# Altium schematic sheet REGENIX_USB-C.SchDoc
size Tabloid; Date: Date; Author: Author 1; DocumentNumber: 3; Revision: 1; SheetNumber: 7; SheetTotal: 17; Size: 11x17; Sheet_Name: ESP32
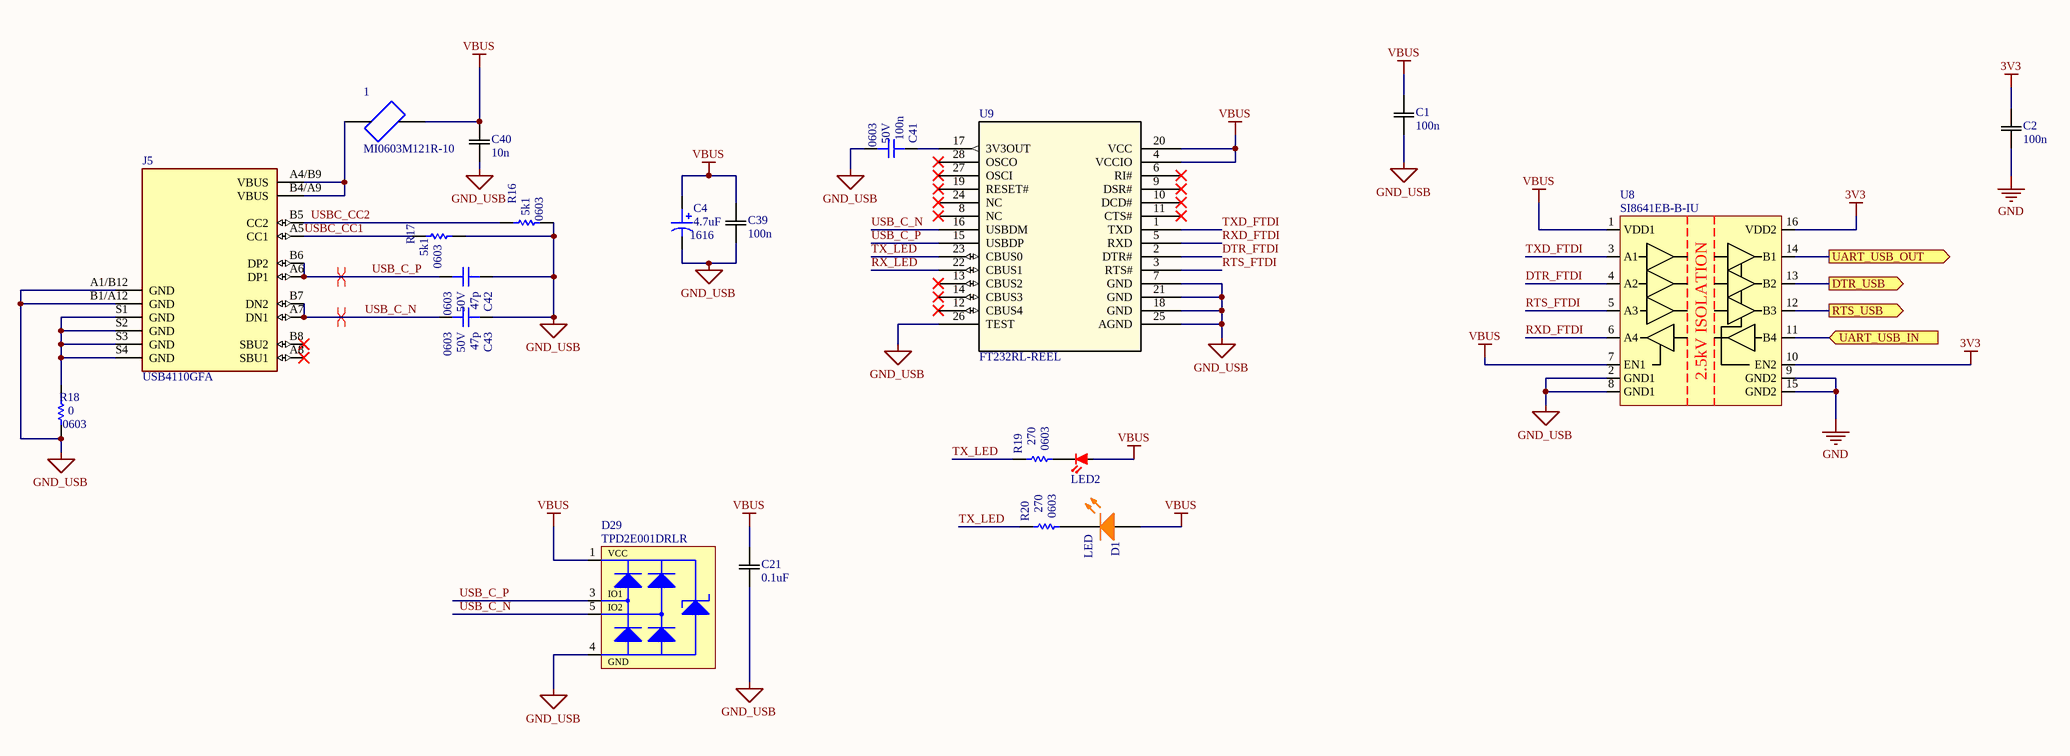
[diagram p0: REGENIX_USB-C.SchDoc]

## Parts
1  MI0603M121R-10  [FB_MI0603M121R-10]
C1  100n  [CAP_CL10_SAM]
C2  100n  [CAP_CL10_SAM]
C4  value 4.7uF  Package: 1616  [CAP_ALU_1616_vishay]  (hidden comment: MAL214699108E3)
C21  0.1uF  [CAP_CL10_SAM]
C39  100n  [CAP_CL10_SAM]
C40  10n  [CAP_CL10_SAM]
C41  value 100n  Voltage: 50V  Package: 0603  [CAP_0603]  (hidden comment: CAP - 0603)
C42  value 47p  Voltage: 50V  Package: 0603  [CAP_0603]  (hidden comment: CAP - 0603)
C43  value 47p  Voltage: 50V  Package: 0603  [CAP_0603]  (hidden comment: CAP - 0603)
D1  LED  [LED_0603]
D29  TPD2E001DRLR  [TVS_USB_TPD2E001DRLR]
J5  USB4110GFA  [GCT_USB4110GFA]
LED2  B1911USD-20D000114U1930  [LED-0603-2PIN]  (value not drawn)
R16  value 5k1  Package: 0603  [RES_0603]  (hidden comment: RES - 0603)
R17  value 5k1  Package: 0603  [RES_0603]  (hidden comment: RES - 0603)
R18  value 0  Package: 0603  [RES_0603]  (hidden comment: RES - 0603)
R19  value 270  Package: 0603  [RES_0603]  (hidden comment: RES - 0603)
R20  value 270  Package: 0603  [RES_0603]  (hidden comment: RES - 0603)
U8  SI8641EB-B-IU  [ISO_SI8641EB-B-IU]
U9  FT232RL-REEL  [IC28_SSOP-28_FTD]

## Ports
DTR_USB (out), RTS_USB (out), UART_USB_IN (in), UART_USB_OUT (out)

## Nets
3V3: C2.2 U8.10(EN2) U8.16(VDD2)
GND: C2.1 U8.9(GND2) U8.15(GND2)
GND_USB: C1.1 C4.2 C21.1 C39.1 C40.1 C41.1 C42.2 C43.2 D29.4(GND) J5.A1/B12(GND) J5.B1/A12(GND) R16.1 R17.1 R18.1 U8.2(GND1) U8.8(GND1) U9.7(GND) U9.18(GND) U9.21(GND) U9.25(AGND) U9.26(TEST)
VBUS: 1.2 C1.2 C4.1 C21.2 C39.2 C40.2 D1.A D29.1(VCC) LED2.2(R) U8.1(VDD1) U8.7(EN1) U9.4(VCCIO) U9.20(VCC)
DTR_FTDI: U8.4(A2) U9.2(DTR#)
DTR_USB: U8.13(B2) ; port DTR_USB
RTS_FTDI: U8.5(A3) U9.3(RTS#)
RTS_USB: U8.12(B3) ; port RTS_USB
RX_LED: U9.22(CBUS1)
RXD_FTDI: U8.6(A4) U9.5(RXD)
TX_LED: R19.2 R20.2 U9.23(CBUS0)
TXD_FTDI: U8.3(A1) U9.1(TXD)
UART_USB_IN: U8.11(B4) ; port UART_USB_IN
UART_USB_OUT: U8.14(B1) ; port UART_USB_OUT
USB_C_N: C43.1 D29.5(IO2) J5.A7(DN1) J5.B7(DN2) U9.16(USBDM)
USB_C_P: C42.1 D29.3(IO1) J5.A6(DP1) J5.B6(DP2) U9.15(USBDP)
USBC_CC1: J5.A5(CC1) R17.2
USBC_CC2: J5.B5(CC2) R16.2
Net1_1: 1.1 J5.A4/B9(VBUS) J5.B4/A9(VBUS)
NetC41_2: C41.2 U9.17(3V3OUT)
NetD1_K: D1.K R20.1
NetJ5_S1: J5.S1(GND) J5.S2(GND) J5.S3(GND) J5.S4(GND) R18.2
NetLED2_1: LED2.1(K) R19.1

Not connected (* = marked no-connect by the designer): D29 2(NC); J5 A8(SBU1)* B8(SBU2)*; U9 6(RI#)* 8(NC)* 9(DSR#)* 10(DCD#)* 11(CTS#)* 12(CBUS4)* 13(CBUS2)* 14(CBUS3)* 19(RESET#)* 24(NC)* 27(OSCI)* 28(OSCO)*

## Layout directives
differential pair: USB_C_N, USB_C_P

## Notes on the sheet
- Sheet Name
- Project Title
- Global Project
- Revision
- Size
- Date
- Group
- Sheet
- of
- Filename
- Designers
- (in symbol ISO_SI8641EB-B-IU) 2.5kV ISOLATION

## Library data of the parts
1 = MI0603M121R-10: Ferrite Bead (Chip Bead), 1.6 x 0.8 x 0.8mm (0603), 120Ohms impedance at 25 MHz; MF: Laird; Package: 0603 Laird; MP: MI0603M121R-10; Check_prices: https://www.snapeda.com/parts/MI0603M121R-10/Laird/view-part/332874/?ref=eda; Value: *; Price: None; Availability: In Stock; SnapEDA_Link: https://www.snapeda.com/parts/MI0603M121R-10/Laird/view-part/332874/?ref=snap
C1 C2 C21 C39 C40 = CL10B104KB8NNWC: CAP CER 0.1UF 50V X7R 0603 CL10B104KB8NNWC; Mfr_Name: Samsung
C4 = CAP_ALU_MAL214699108E3: CAP - ALU 470uF 20% 50V - 1616; Current: 1.3A; Mfg: Vishay Dale; Mfg Part Number: MAL214699108E3; HelpURL: http://www.vishay.com/docs/28403/146cti.pdf; CreatedBy: Jonathan Bouchard; Temperature: -55°C to 125°C; Power: *; Supplier 1: Digikey; Supplier Part Number 1: 4442PHCT-ND
C41-C43 = CAP - 0603: Precision: 10%; Current: *; CreatedBy: Jonathan Bouchard; Power: *
D1 = LED_SML-311DTT86: LED - 611nM ORANGE 2mA - 0603 SML-311DTT86; Voltage: 1.8V; Mfg: ROHM Semiconductor; Power: 44mW; Current: 2mA; HelpURL: http://media.digikey.com/pdf/Data%20Sheets/Rohm%20PDFs/SML-311%20Series.pdf; CreatedBy: Jonathan Bouchard; Temperature: -40°C to 85°C; Package: 0603; Precision: *; Mfg Part Number: SML-311DTT86; Supplier 1: Digikey; Supplier Part Number 1: 511-1303-1-ND
D29 = TVS_USB_TPD2E001DRLR: TVS - USB TVS DIODE 5.5V - SOT-553; Manufacturer #1: Texas Instruments; Value: 11V Breakdown; Voltage Rating: 5.5V (Max); GRAMS Lib Spec: 2.8; Magnetic Material: YES; Cryo: UNKNOWN; Tolerance: *; Current Rating: *; Power Max: *; HelpURL: http://www.ti.com/lit/ds/symlink/tpd2e001.pdf; CreatedBy/Date: Jonathan Bouchard 2018-07-10; VerifiedBy: Arnaud Samson 16-07-18; Temperature: -40°C ~ 85°C (TA); Package: SOT-553; Manufacturer #2: *; Note: *; Assembly Type: SMD; Part Number #2: *; Part Number #1: TPD2E001DRLR; Polarized: YES; Supplier 1: Digi-Key; Supplier Part Number 1: 296-21883-1-ND
J5 = USB4110GFA: USB-C (USB TYPE-C) USB 2.0 Receptacle Connector 24 (16+8 Dummy) Position Surface Mount, Right Angle; MF: Global Connector Technology; SnapEDA_Link: https://www.snapeda.com/parts/USB4110GFA/Global+Connector+Technology/view-part/?ref=snap; Package: None; Value: *; MP: USB4110GFA; Check_prices: https://www.snapeda.com/parts/USB4110GFA/Global+Connector+Technology/view-part/?ref=eda
LED2 = B1911USD-20D000114U1930: LED RED CLEAR 1608 SMD; Package / Case: 0603 (1608 Metric); Mounted: Yes; Supplier 1: Digi-Key; Supplier Part Number 1: 3147-B1911USD-20D000114U1930CT-ND
U8 = ISO_SI8641EB-B-IU: ISO - Quad-Channel Digital Isolator - 16-SSOP; Manufacturer #1: Silicon Labs; Part Number #1: SI8641BA-B-IUR; Voltage Rating: 2.375-5.5V; GRAMS Lib Spec: 2.8c; Magnetic Material: Unknown; Polarized: Yes; Value: *; Tolerance: *; Current Rating: *; Power Max: *; HelpURL: https://www.silabs.com/documents/public/data-sheets/si864x-datasheet.pdf; CreatedBy/Date: Louis-Daniel Gaulin / 25-02-2020; VerifiedBy: C.Paulin - 9/03/2020; Temperature: -40°C ~ 125°C; Package: 16-SSOP; Manufacturer #2: *; Assembly Type: SMD; Part Number #2: *; Supplier 1: Digi-Key; Supplier Part Number 1: 336-4333-1-ND; Cryo: UNKNOWN
U9 = FT232RL-REEL: No Description Available; Mfr_Name: FTDI, Future Technology Devices International Ltd; RefDes: RefDes; Type: Type
R16-R20 = RES - 0603: Current: *; CreatedBy: Jonathan Bouchard